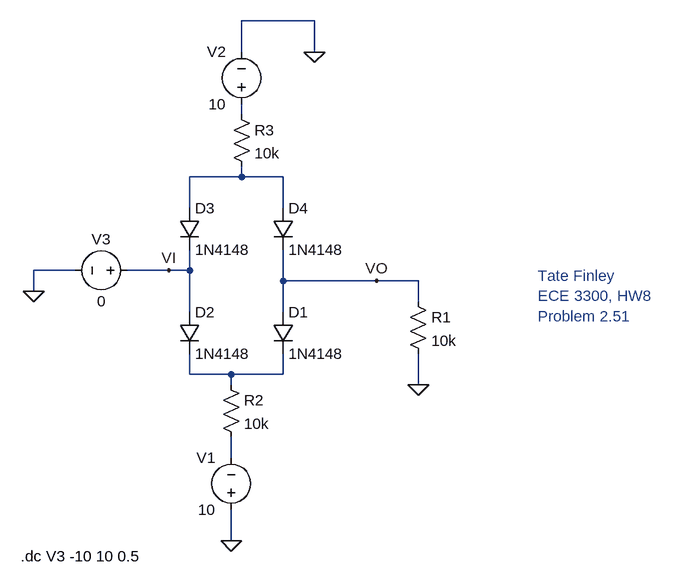
[diagram p0: schematic ECE3300_Hw8_diodecircuit.asc]
ECE3300_Hw8_diodecircuit.asc, the LTspice schematic file:
Version 4
SHEET 1 880 680
WIRE 160 -352 48 -352
WIRE 48 -304 48 -352
WIRE 160 -304 160 -352
WIRE 48 -208 48 -224
WIRE 48 -112 48 -128
WIRE 48 -112 -32 -112
WIRE 112 -112 48 -112
WIRE -32 -64 -32 -112
WIRE 112 -64 112 -112
WIRE -208 32 -272 32
WIRE -64 32 -128 32
WIRE -32 32 -32 0
WIRE -32 32 -64 32
WIRE 112 48 112 0
WIRE 256 48 112 48
WIRE 320 48 256 48
WIRE -272 64 -272 32
WIRE 320 80 320 48
WIRE -32 96 -32 32
WIRE 112 96 112 48
WIRE -32 192 -32 160
WIRE 32 192 -32 192
WIRE 112 192 112 160
WIRE 112 192 32 192
WIRE 32 208 32 192
WIRE 320 208 320 160
WIRE 32 320 32 288
WIRE 32 448 32 400
FLAG 320 208 0
FLAG 32 448 0
FLAG 160 -304 0
FLAG -272 64 0
FLAG -64 32 VI
FLAG 256 48 VO
SYMBOL res 304 64 R0
SYMATTR InstName R1
SYMATTR Value 10k
SYMBOL res 16 192 R0
SYMATTR InstName R2
SYMATTR Value 10k
SYMBOL voltage 32 416 R180
WINDOW 0 24 96 Left 2
WINDOW 3 24 16 Left 2
WINDOW 123 0 0 Left 0
WINDOW 39 0 0 Left 0
SYMATTR InstName V1
SYMATTR Value 10
SYMBOL diode 96 96 R0
SYMATTR InstName D1
SYMATTR Value 1N4148
SYMBOL diode -48 96 R0
SYMATTR InstName D2
SYMATTR Value 1N4148
SYMBOL diode -48 -64 R0
SYMATTR InstName D3
SYMATTR Value 1N4148
SYMBOL diode 96 -64 R0
SYMATTR InstName D4
SYMATTR Value 1N4148
SYMBOL voltage 48 -208 R180
WINDOW 0 24 96 Left 2
WINDOW 3 24 16 Left 2
WINDOW 123 0 0 Left 0
WINDOW 39 0 0 Left 0
SYMATTR InstName V2
SYMATTR Value 10
SYMBOL res 32 -224 R0
SYMATTR InstName R3
SYMATTR Value 10k
SYMBOL voltage -112 32 R90
WINDOW 0 -32 56 VBottom 2
WINDOW 3 32 56 VTop 2
WINDOW 123 0 0 Left 0
WINDOW 39 0 0 Left 0
SYMATTR InstName V3
SYMATTR Value 0
TEXT -292 472 Left 2 !.dc V3 -10 10 0.5
TEXT 504 40 Left 2 ;Tate Finley\nECE 3300, HW8\nProblem 2.51

The netlist it stands for:
* ECE3300_Hw8_diodecircuit.asc
R1 VO 0 10k
R2 N003 N004 10k
V1 0 N004 10
D1 VO N003 1N4148
D2 VI N003 1N4148
D3 N002 VI 1N4148
D4 N002 VO 1N4148
V2 N001 0 10
R3 N001 N002 10k
V3 VI 0 0
.model D D
.lib standard.dio
.dc V3 -10 10 0.5
* Tate Finley
* ECE 3300, HW8
* Problem 2.51
.backanno
.end